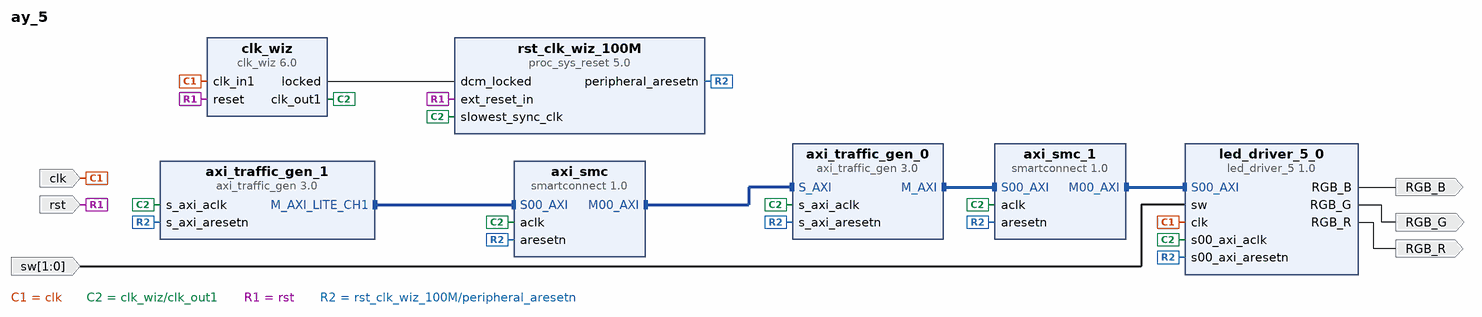
[diagram p0: block diagram of the top level]
# Vivado block design ay_5, xc7z010clg400-1, Vivado 2020.1
create_bd_design ay_5

create_bd_port -dir I -type clk clk
create_bd_port -dir I -from 1 -to 0 sw
create_bd_port -dir I -type rst rst
set_property -dict {CONFIG.POLARITY ACTIVE_HIGH} [get_bd_ports rst]
create_bd_port -dir O RGB_R
create_bd_port -dir O RGB_G
create_bd_port -dir O RGB_B

create_bd_cell -type ip -vlnv xilinx.com:ip:axi_traffic_gen:3.0 axi_traffic_gen_0
set_property -dict [list \
  CONFIG.C_ATG_MODE AXI4 \
  CONFIG.C_ATG_SYSTEM_INIT_ADDR_MIF ../../../../../../../COE_FILES/addr.coe \
  CONFIG.C_ATG_SYSTEM_INIT_CTRL_MIF ../../../../../../../COE_FILES/ctrl.coe \
  CONFIG.C_ATG_SYSTEM_INIT_DATA_MIF ../../../../../../../COE_FILES/data.coe \
  CONFIG.C_ATG_SYSTEM_INIT_MASK_MIF ../../../../../../../COE_FILES/mask.coe \
] [get_bd_cells axi_traffic_gen_0]
create_bd_cell -type ip -vlnv xilinx.com:ip:axi_traffic_gen:3.0 axi_traffic_gen_1
set_property -dict [list \
  CONFIG.C_ATG_MIF_DATA_DEPTH 32 \
  CONFIG.C_ATG_MODE AXI4-Lite \
  CONFIG.C_ATG_SYSINIT_MODES System_Test \
  CONFIG.C_ATG_SYSTEM_INIT_ADDR_MIF ../../../../../../../COE_FILES/addr.coe \
  CONFIG.C_ATG_SYSTEM_INIT_CTRL_MIF ../../../../../../../COE_FILES/ctrl.coe \
  CONFIG.C_ATG_SYSTEM_INIT_DATA_MIF ../../../../../../../COE_FILES/data.coe \
  CONFIG.C_ATG_SYSTEM_INIT_MASK_MIF ../../../../../../../COE_FILES/mask.coe \
] [get_bd_cells axi_traffic_gen_1]
create_bd_cell -type ip -vlnv xilinx.com:user:led_driver_5:1.0 led_driver_5_0
create_bd_cell -type ip -vlnv xilinx.com:ip:smartconnect:1.0 axi_smc
set_property -dict {CONFIG.NUM_SI 1} [get_bd_cells axi_smc]
create_bd_cell -type ip -vlnv xilinx.com:ip:clk_wiz:6.0 clk_wiz
create_bd_cell -type ip -vlnv xilinx.com:ip:proc_sys_reset:5.0 rst_clk_wiz_100M
create_bd_cell -type ip -vlnv xilinx.com:ip:smartconnect:1.0 axi_smc_1
set_property -dict {CONFIG.NUM_SI 1} [get_bd_cells axi_smc_1]

# ---- connections ----

connect_bd_intf_net [get_bd_intf_pins axi_traffic_gen_0/M_AXI] [get_bd_intf_pins axi_smc_1/S00_AXI]
connect_bd_intf_net [get_bd_intf_pins axi_smc_1/M00_AXI] [get_bd_intf_pins led_driver_5_0/S00_AXI]
connect_bd_intf_net [get_bd_intf_pins axi_traffic_gen_1/M_AXI_LITE_CH1] [get_bd_intf_pins axi_smc/S00_AXI]
connect_bd_intf_net [get_bd_intf_pins axi_smc/M00_AXI] [get_bd_intf_pins axi_traffic_gen_0/S_AXI]
connect_bd_net -net clk_0_1 [get_bd_ports clk] [get_bd_pins led_driver_5_0/clk] [get_bd_pins clk_wiz/clk_in1]
connect_bd_net [get_bd_pins clk_wiz/clk_out1] \
  [get_bd_pins axi_traffic_gen_1/s_axi_aclk] [get_bd_pins axi_smc/aclk] [get_bd_pins rst_clk_wiz_100M/slowest_sync_clk] \
  [get_bd_pins axi_traffic_gen_0/s_axi_aclk] [get_bd_pins axi_smc_1/aclk] [get_bd_pins led_driver_5_0/s00_axi_aclk]
connect_bd_net [get_bd_pins clk_wiz/locked] [get_bd_pins rst_clk_wiz_100M/dcm_locked]
connect_bd_net [get_bd_pins led_driver_5_0/RGB_B] [get_bd_ports RGB_B]
connect_bd_net [get_bd_pins led_driver_5_0/RGB_G] [get_bd_ports RGB_G]
connect_bd_net [get_bd_pins led_driver_5_0/RGB_R] [get_bd_ports RGB_R]
connect_bd_net -net reset_0_1 [get_bd_ports rst] [get_bd_pins clk_wiz/reset] [get_bd_pins rst_clk_wiz_100M/ext_reset_in]
connect_bd_net [get_bd_pins rst_clk_wiz_100M/peripheral_aresetn] \
  [get_bd_pins axi_traffic_gen_1/s_axi_aresetn] [get_bd_pins axi_traffic_gen_0/s_axi_aresetn] [get_bd_pins axi_smc/aresetn] \
  [get_bd_pins led_driver_5_0/s00_axi_aresetn] [get_bd_pins axi_smc_1/aresetn]
connect_bd_net -net sw_0_1 [get_bd_ports sw] [get_bd_pins led_driver_5_0/sw]

# ---- address map ----
assign_bd_address -offset 0x76000000 -range 64K -target_address_space [get_bd_addr_spaces axi_traffic_gen_0/Data] [get_bd_addr_segs led_driver_5_0/S00_AXI/S00_AXI_mem]
assign_bd_address -offset 0x44A00000 -range 64K -target_address_space [get_bd_addr_spaces axi_traffic_gen_1/Reg1] [get_bd_addr_segs axi_traffic_gen_0/S_AXI/Reg0]

validate_bd_design
save_bd_design
